# EAGLE design DP2MBPR_1.0 (EAGLE 6.4)

## Sheet 1 of 4: Power Management

## Sheet 2 of 4: Processor
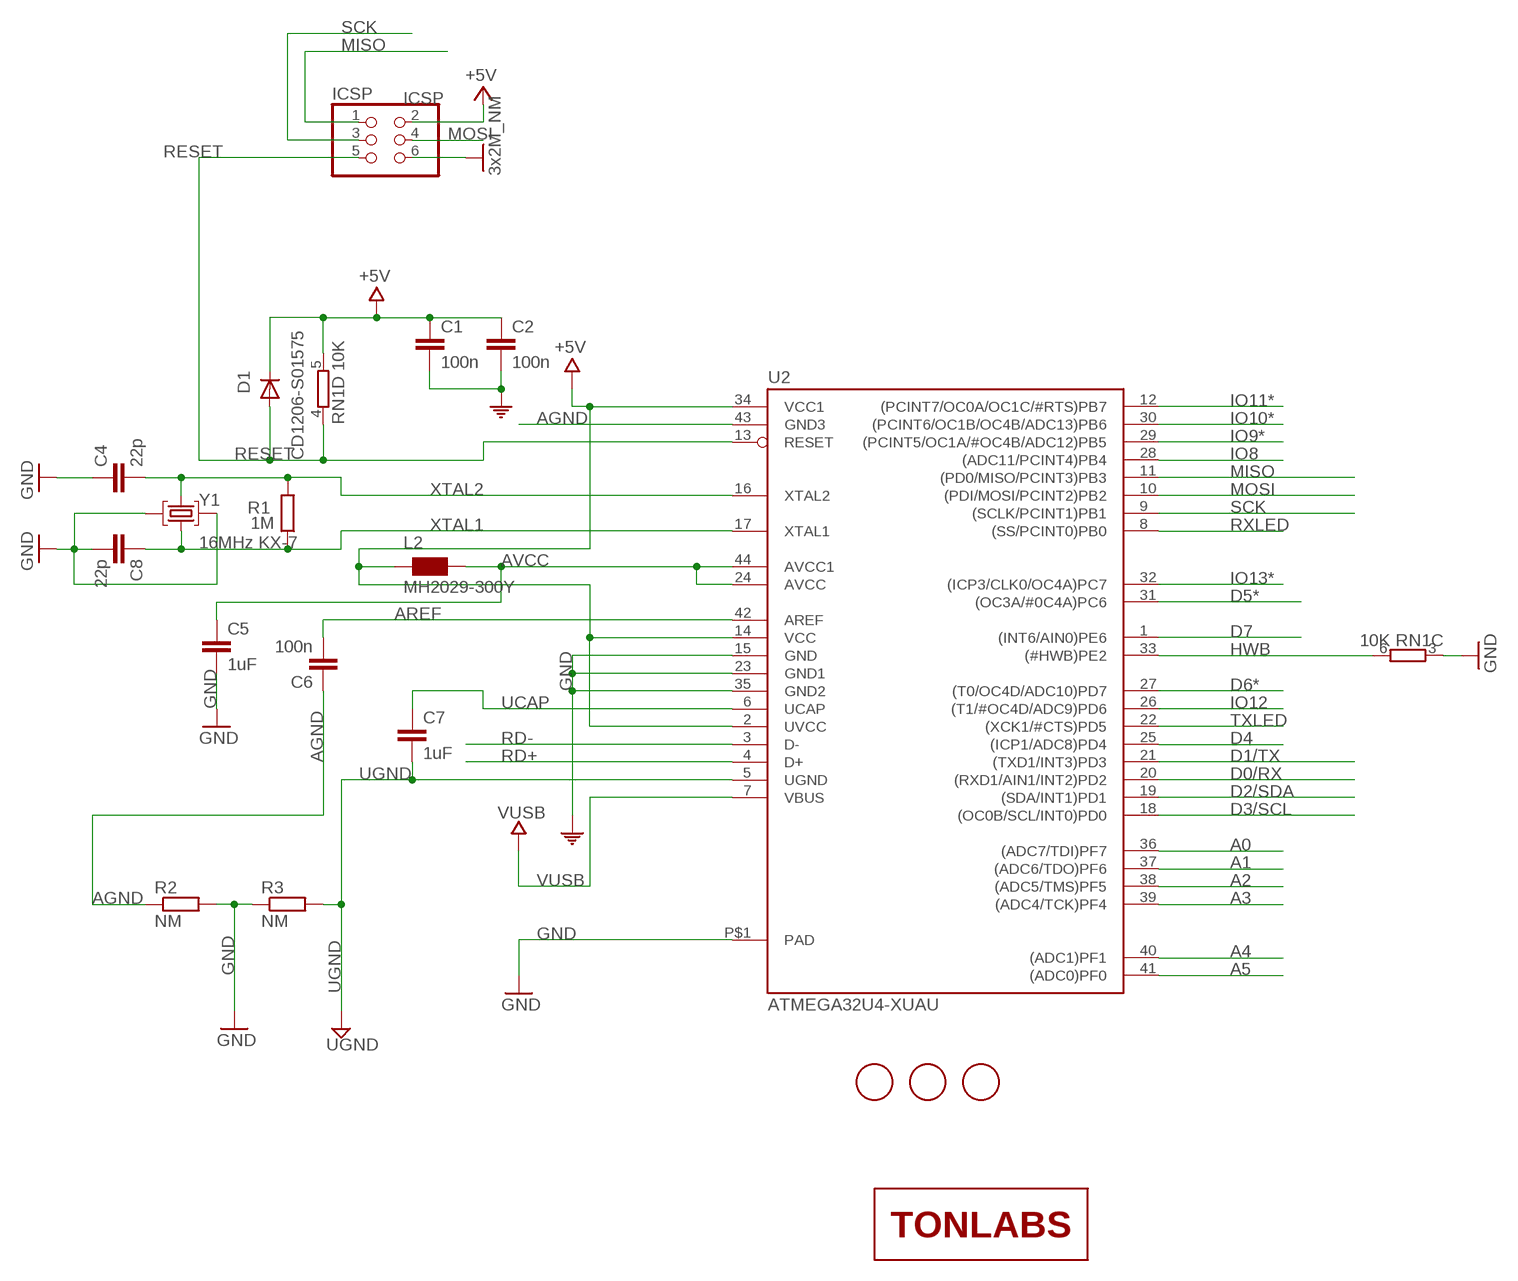
[diagram p0: schematic, sheet 2]

### Parts
C1  100n  C-EUC0603  [C0603-ROUND]
C2  100n  C-EUC0603  [C0603-ROUND]
C4  22p  C-EUC0603  [C0603-ROUND]
C5  1uF  C-EUC0603  [C0603-ROUND]
C6  100n  C-EUC0603  [C0603-ROUND]
C7  1uF  C-EUC0603  [C0603-ROUND]
C8  22p  C-EUC0603  [C0603-ROUND]
D1  CD1206-S01575  DIODE-MINIMELF  [MINIMELF]
FID1  FIDUCIALMOUNT  [FIDUCIA-MOUNT]
FID2  FIDUCIALMOUNT  [FIDUCIA-MOUNT]
FID3  FIDUCIALMOUNT  [FIDUCIA-MOUNT]
ICSP  ICSP  PINHD-2X3  [2X03]
L2  MH2029-300Y  WE-CBF_0805  [0805]
LOGO1  LOGO-TONYLABSMED-LANDSCAPE  [LOGO-TONYLABS-MED-LANDSCAPE]
R1  1M  R-EU_R0603  [R0603-ROUND]
R2  NM  R-EU_R0402  [R0402]
R3  NM  R-EU_R0402  [R0402]
RN1  10K  4R-NCAY16  [CAY16]
U2  ATMEGA32U4-XUAU  [TQFP44-PAD]
Y1  16MHz KX-7  CRYSTAL-3.2-2.5  [CRYSTAL-3.2-2.5]

### Nets
+5V [usbvcc]: C1.1 C2.1 D1.C ICSP.2 L2.1 RN1.5 U2.2(UVCC) U2.14(VCC) U2.34(VCC1)
A0: U2.36((ADC7/TDI)PF7)
A1: U2.37((ADC6/TDO)PF6)
A2: U2.38((ADC5/TMS)PF5)
A3: U2.39((ADC4/TCK)PF4)
A4: U2.40((ADC1)PF1)
A5: U2.41((ADC0)PF0)
AGND: C6.1 R2.1 U2.43(GND3)
AREF [aref]: C6.2 U2.42(AREF)
AVCC: C5.1 L2.2 U2.24(AVCC) U2.44(AVCC1)
D0/RX: U2.20((RXD1/AIN1/INT2)PD2)
D1/TX: U2.21((TXD1/INT3)PD3)
D2/SDA: U2.19((SDA/INT1)PD1)
D3/SCL: U2.18((OC0B/SCL/INT0)PD0)
D4: U2.25((ICP1/ADC8)PD4)
D5*: U2.31((OC3A/#0C4A)PC6)
D6*: U2.27((T0/OC4D/ADC10)PD7)
D7: U2.1((INT6/AIN0)PE6)
GND: C1.2 C2.2 C4.1 C5.2 C8.2 ICSP.6 R2.2 R3.1 RN1.3 U2.15(GND) U2.23(GND1) U2.35(GND2) U2.P$1(PAD) Y1.2(GND) Y1.4(GND) ; supply symbol labelled 3x2M_NM, COM ; also sheet 3,4
HWB: RN1.6 U2.33((#HWB)PE2)
IO8: U2.28((ADC11/PCINT4)PB4)
IO9*: U2.29((PCINT5/OC1A/#OC4B/ADC12)PB5)
IO10*: U2.30((PCINT6/OC1B/OC4B/ADC13)PB6)
IO11*: U2.12((PCINT7/OC0A/OC1C/#RTS)PB7)
IO12: U2.26((T1/#OC4D/ADC9)PD6)
IO13*: U2.32((ICP3/CLK0/OC4A)PC7)
MISO: ICSP.1 U2.11((PD0/MISO/PCINT3)PB3)
MOSI: ICSP.4 U2.10((PDI/MOSI/PCINT2)PB2)
RD+: U2.4(D+)
RD-: U2.3(D-)
RESET: D1.A ICSP.5 RN1.4 U2.13(RESET)
RXLED: U2.8((SS/PCINT0)PB0)
SCK: ICSP.3 U2.9((SCLK/PCINT1)PB1)
TXLED: U2.22((XCK1/#CTS)PD5)
UCAP: C7.1 U2.6(UCAP)
UGND [gnd]: C7.2 R3.2 U2.5(UGND)
VUSB: U2.7(VBUS)
XTAL1: C8.1 R1.1 U2.17(XTAL1) Y1.1(C1)
XTAL2: C4.2 R1.2 U2.16(XTAL2) Y1.3(C2)
Unconnected: RN1.1 RN1.2 RN1.7 RN1.8

## Sheet 3 of 4: Backlight Driver
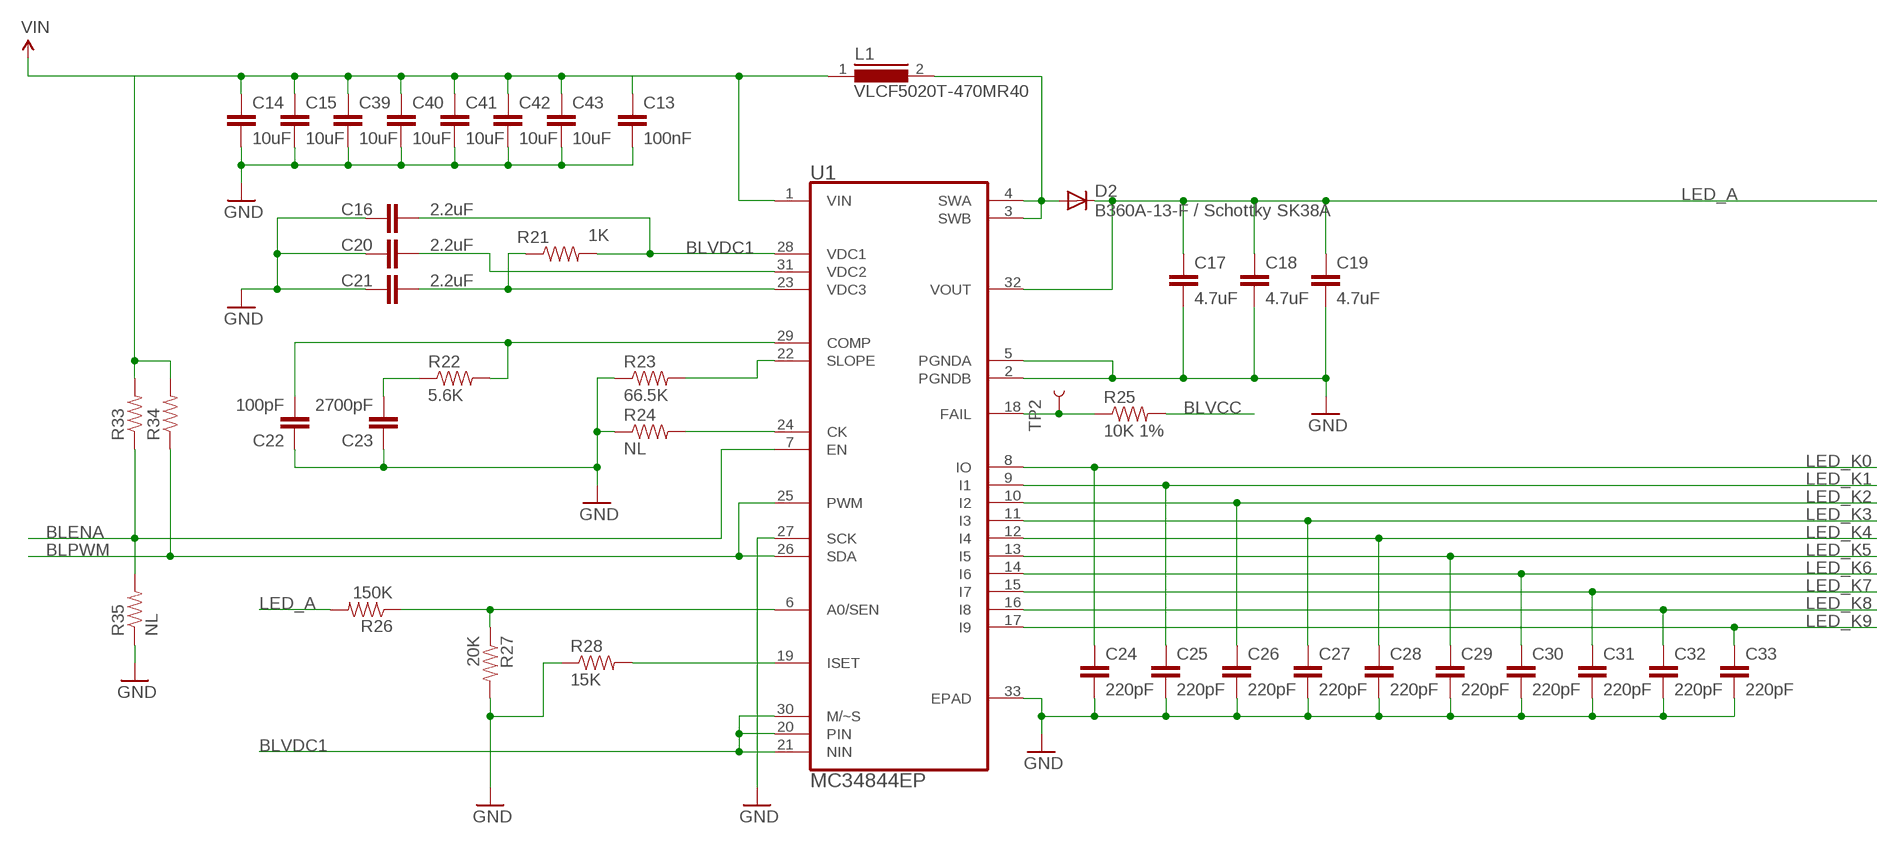
[diagram p1: schematic, sheet 3]

### Parts
C13  100nF  CAP0805  [0805]
C14  10uF  CAP0805  [0805]
C15  10uF  CAP0805  [0805]
C16  2.2uF  CAP0805  [0805]
C17  4.7uF  CAP1210  [1210]
C18  4.7uF  CAP1210  [1210]
C19  4.7uF  CAP1210  [1210]
C20  2.2uF  CAP0805  [0805]
C21  2.2uF  CAP0805  [0805]
C22  100pF  CAP0805  [0805]
C23  2700pF  CAP0805  [0805]
C24  220pF  CAP0603-CAP  [0603-CAP]
C25  220pF  CAP0603-CAP  [0603-CAP]
C26  220pF  CAP0603-CAP  [0603-CAP]
C27  220pF  CAP0603-CAP  [0603-CAP]
C28  220pF  CAP0603-CAP  [0603-CAP]
C29  220pF  CAP0603-CAP  [0603-CAP]
C30  220pF  CAP0603-CAP  [0603-CAP]
C31  220pF  CAP0603-CAP  [0603-CAP]
C32  220pF  CAP0603-CAP  [0603-CAP]
C33  220pF  CAP0603-CAP  [0603-CAP]
C39  10uF  CAP0805  [0805]
C40  10uF  CAP0805  [0805]
C41  10uF  CAP0805  [0805]
C42  10uF  CAP0805  [0805]
C43  10uF  CAP0805  [0805]
D2  B360A-13-F / Schottky SK38A  DIODE-SMB  [SMB]
L1  VLCF5020T-470MR40  SLF7045  [SLF7045]
R21  1K  RESISTOR0603-RES  [0603-RES]
R22  5.6K  RESISTOR0603-RES  [0603-RES]
R23  66.5K  RESISTOR0603-RES  [0603-RES]
R24  NL  RESISTOR0603-RES  [0603-RES]
R25  10K 1%  RESISTOR0603-RES  [0603-RES]
R26  150K  RESISTOR0603-RES  [0603-RES]
R27  20K  RESISTOR0603-RES  [0603-RES]
R28  15K  RESISTOR0603-RES  [0603-RES]
R33  RESISTOR0603-RES  [0603-RES]
R34  RESISTOR0603-RES  [0603-RES]
R35  NL  RESISTOR0603-RES  [0603-RES]
TP2  TEST-POINT3X5  [PAD.03X.05]
U1  MC34844EP  IC-FREESCALE-MC34844EP  [QFN50P500X500X100-33N]

### Nets
BLENA: R33.1 R35.2 U1.7(EN)
BLPWM: R34.1 U1.25(PWM) U1.26(SDA)
BLVCC: R25.2
BLVDC1: C16.2 R21.2 U1.20(PIN) U1.21(NIN) U1.28(VDC1) U1.30(M/~S)
GND: C13.2 C14.2 C15.2 C16.1 C17.2 C18.2 C19.2 C20.1 C21.1 C22.1 C23.1 C24.2 C25.2 C26.2 C27.2 C28.2 C29.2 C30.2 C31.2 C32.2 C33.2 C39.2 C40.2 C41.2 C42.2 C43.2 R23.1 R24.1 R27.2 R28.1 R35.1 U1.2(PGNDB) U1.5(PGNDA) U1.27(SCK) U1.33(EPAD) ; also sheet 2,4
LED_A: C17.1 C18.1 C19.1 D2.C R26.2 U1.32(VOUT) ; also sheet 4
LED_K0: C24.1 U1.8(IO)
LED_K1: C25.1 U1.9(I1) ; also sheet 4
LED_K2: C26.1 U1.10(I2) ; also sheet 4
LED_K3: C27.1 U1.11(I3) ; also sheet 4
LED_K4: C28.1 U1.12(I4) ; also sheet 4
LED_K5: C29.1 U1.13(I5) ; also sheet 4
LED_K6: C30.1 U1.14(I6) ; also sheet 4
LED_K7: C31.1 U1.15(I7)
LED_K8: C32.1 U1.16(I8)
LED_K9: C33.1 U1.17(I9)
N$1: C22.2 R22.2 U1.29(COMP)
N$8: C20.2 U1.31(VDC2)
N$24: R25.1 TP2.P$1 U1.18(FAIL)
N$25: C21.2 R21.1 U1.23(VDC3)
N$39: C23.2 R22.1
N$40: R23.2 U1.22(SLOPE)
N$41: R24.2 U1.24(CK)
N$42: R26.1 R27.1 U1.6(A0/SEN)
N$46: D2.A L1.2 U1.3(SWB) U1.4(SWA)
N$47: R28.2 U1.19(ISET)
VIN: C13.1 C14.1 C15.1 C39.1 C40.1 C41.1 C42.1 C43.1 L1.1 R33.2 R34.2 U1.1(VIN)

## Sheet 4 of 4: Connectors
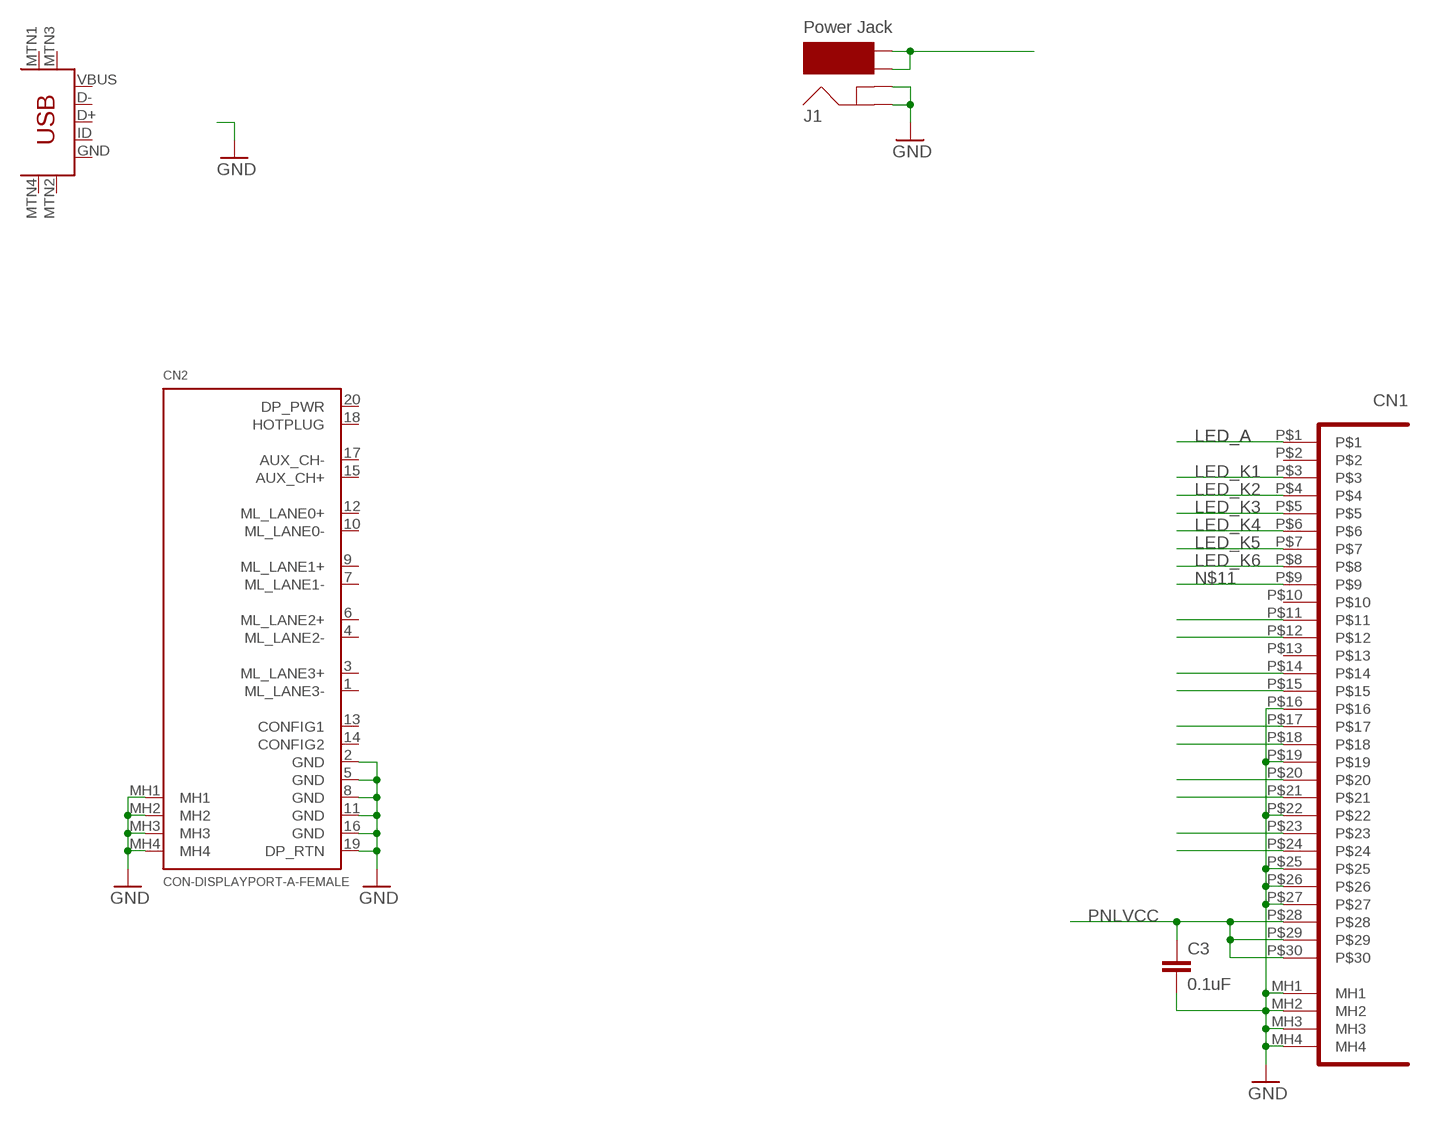
[diagram p2: schematic, sheet 4]

### Parts
C3  0.1uF  CAP0603-CAP  [0603-CAP]
CN1  CON-I_PEX-20474-030E  [CON-I_PEX-20474-030E-0.4PITCH_30PIN-SMT]
CN2  CON-DISPLAYPORT-A-FEMALE  [CON-DISPLAYPORT-FEMALE-SMT]
J1  Power Jack  CON-POWER-JACK-4P  [CON-POWER-JACK-4P]
U$1  USB-MINIB-5PIN  [USB-MINIB]

### Nets
GND: C3.2 CN1.MH1 CN1.MH2 CN1.MH3 CN1.MH4 CN1.P$16 CN1.P$19 CN1.P$22 CN1.P$25 CN1.P$26 CN1.P$27 CN2.2(GND) CN2.5(GND) CN2.8(GND) CN2.11(GND) CN2.16(GND) CN2.19(DP_RTN) CN2.MH1 CN2.MH2 CN2.MH3 CN2.MH4 J1.GND J1.P$4(GNDBREAK) ; also sheet 2,3
LED_A: CN1.P$1 ; also sheet 3
LED_K1: CN1.P$3 ; also sheet 3
LED_K2: CN1.P$4 ; also sheet 3
LED_K3: CN1.P$5 ; also sheet 3
LED_K4: CN1.P$6 ; also sheet 3
LED_K5: CN1.P$7 ; also sheet 3
LED_K6: CN1.P$8 ; also sheet 3
N$11: CN1.P$9
N$13: CN1.P$11
N$14: CN1.P$12
N$16: CN1.P$14
N$17: CN1.P$15
N$19: CN1.P$17
N$20: CN1.P$18
N$22: CN1.P$20
N$23: CN1.P$21
N$27: CN1.P$23
N$28: CN1.P$24
N$44: J1.VIN0(PWR) J1.VIN1(PWR1)
PNLVCC: C3.1 CN1.P$28 CN1.P$29 CN1.P$30
Unconnected: CN1.P$2 CN1.P$10 CN1.P$13 CN2.1(ML_LANE3-) CN2.3(ML_LANE3+) CN2.4(ML_LANE2-) CN2.6(ML_LANE2+) CN2.7(ML_LANE1-) CN2.9(ML_LANE1+) CN2.10(ML_LANE0-) CN2.12(ML_LANE0+) CN2.13(CONFIG1) CN2.14(CONFIG2) CN2.15(AUX_CH+) CN2.17(AUX_CH-) CN2.18(HOTPLUG) CN2.20(DP_PWR) U$1.D+ U$1.D- U$1.GND U$1.ID U$1.MTN1(MTN2) U$1.MTN2(MTN3) U$1.MTN3(MTN1) U$1.MTN4 U$1.VBUS

## Library data of the parts
C1 C2 C4-C8 = SmartPrj:C-EU: CAPACITOR, European symbol
C3 C13-C33 C39-C43 = SparkFun-Passives:CAP: Capacitor Standard 0603 ceramic capacitor, and 0.1" leaded capacitor.
CN1 = TONYLABS:CON-I_PEX-20474-030E
CN2 = TONYLABS:CON-DISPLAYPORT-A-FEMALE: Displayport Female 20pin SMT
D1 D2 = diode:DIODE-: DIODE
FID1-FID3 = SmartPrj:FIDUCIALMOUNT
ICSP = SmartPrj:PINHD-2X3: PIN HEADER
J1 = TONYLABS:CON-POWER-JACK-4P
L1 = inductors:SLF7045: SMD Inductors(Coils) For Power Line (Wound, Magnetic Shielded) Source: TDK, e531_slf7045.pdf
L2 = wuerth-elektronik:WE-CBF: SMD EMI Suppression Ferrite Beads - excellent anti-EMI properties - low DCR - impedances till 3000 ohms - rated current up to 6 A
LOGO1 = TONYLABS:LOGO-TONYLABS
R1-R3 = SmartPrj:R-EU_: RESISTOR, European symbol
R21-R28 R33-R35 = SparkFun-Passives:RESISTOR: Resistor Basic schematic elements and footprints for 0603, 1206, and PTH resistors.
RN1 = resistor-dil:4R-N: Array Chip Resistor Source: RS Component / Phycomp
TP2 = SparkFun-Passives:TEST-POINT: Bare copper test points for troubleshooting or ICT
U1 = TONYLABS:IC-FREESCALE-MC34844EP: 10 Channel LED Backlight Driver; MPN: MC34844EP; OC_FARNELL: 1701636; OC_NEWARK: 40P5024; PACKAGE: QFN-32; SUPPLIER: FREESCALE SEMICONDUCTOR
U2 = SmartPrj:ATMEGA32U4-XU
U$1 = SparkFun-Connectors:USB-MINIB: Mini-USB "B" connector with 5th pin broken out. Created new symbol breaking out 5th "ID" pin in mini/micro USB connector spec. See: http://en.wikipedia.org/wiki/Mini_usb#Cables. Uses same footprint as 4-pin symbol. Also added pins to connect to mounting / shield pads if required (probably not generally needed as signals aren't shielded once they leave the connector).
Y1 = SmartPrj:CRYSTAL-3.2-2.5

## Net classes
0 default: width 0.254 mm, drill 0.61 mm, clearance 0.254 mm
1 power: width 0.254 mm, drill 0.61 mm, clearance 0.254 mm
2 gnd: width 0.254 mm, drill 0.61 mm, clearance 0.254 mm
3 usbvcc: width 0.254 mm, drill 0.61 mm, clearance 0.254 mm
4 aref: width 0.254 mm, drill 0.61 mm, clearance 0.254 mm

## Board
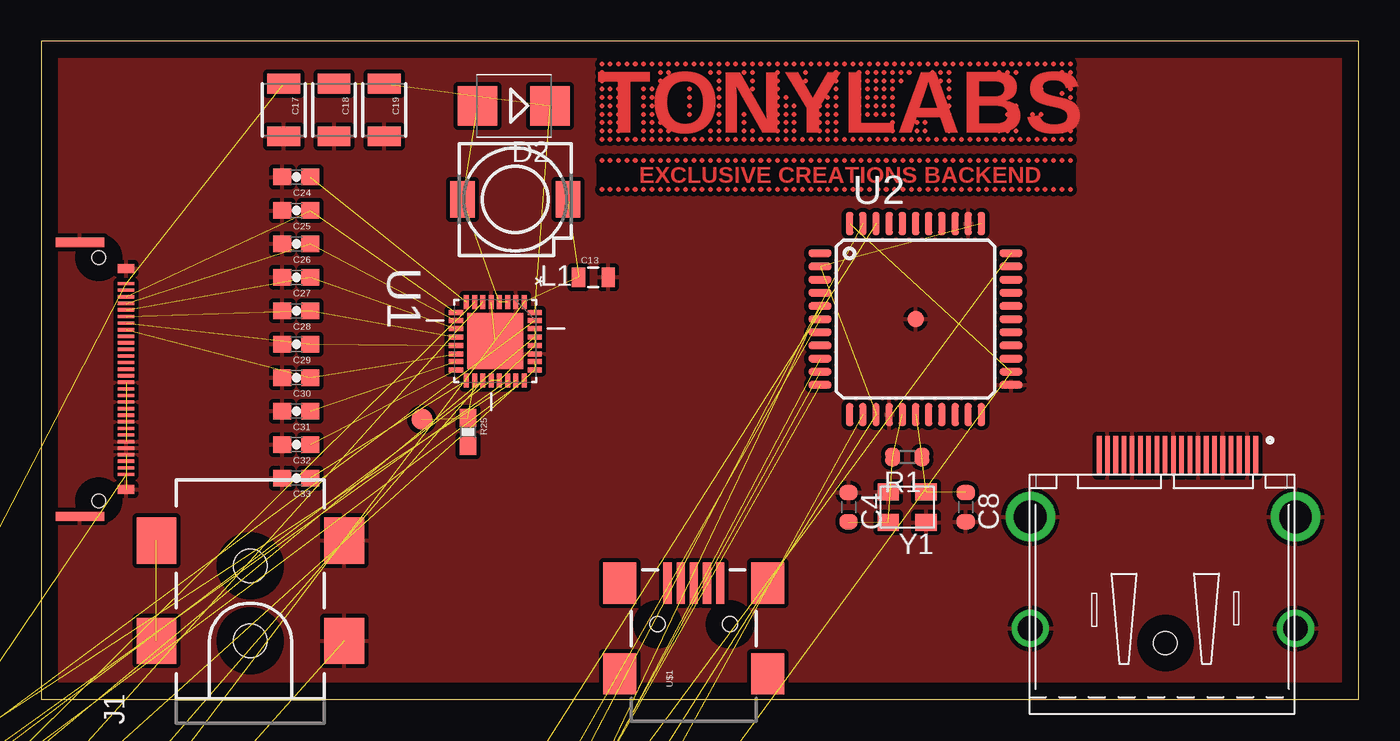
[diagram p3: board, top side]
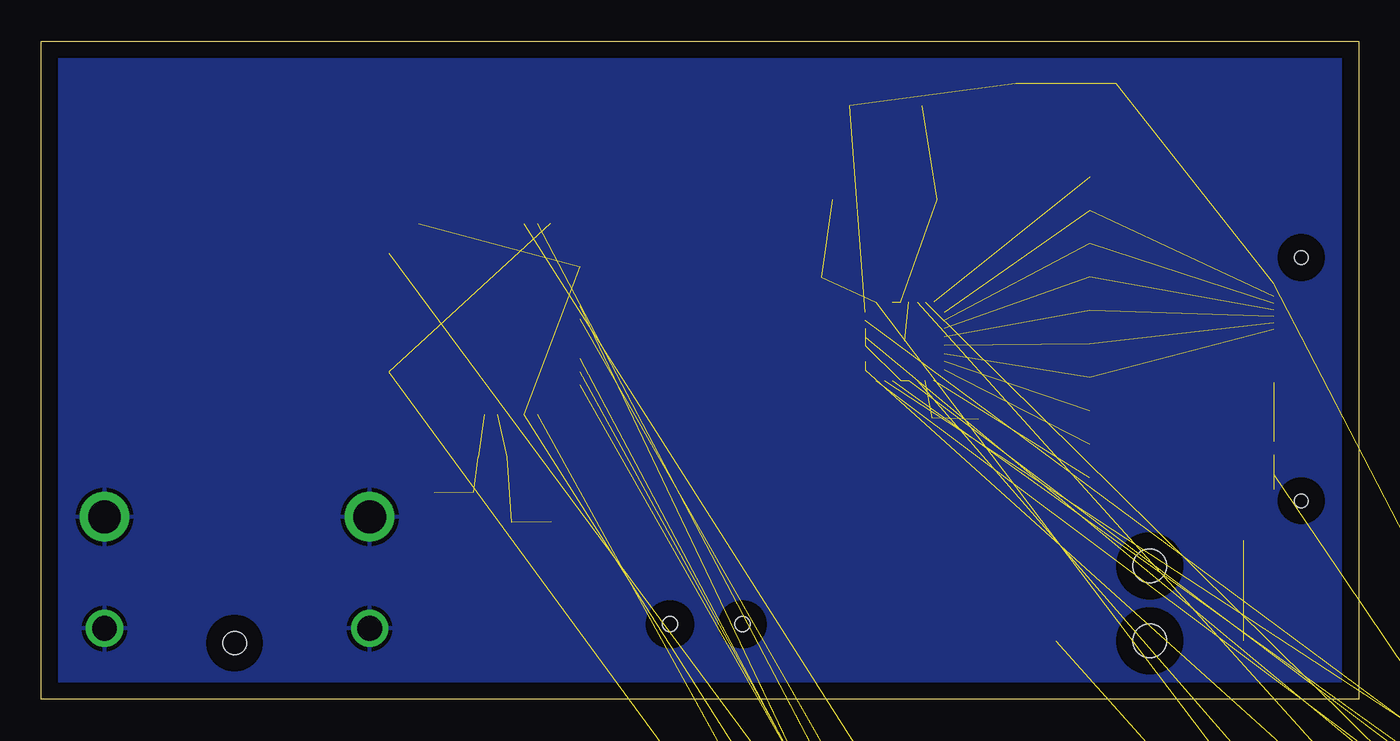
[diagram p4: board, bottom side, seen from below]

Size 80 x 40 mm. Coordinates in mm from the lower left corner, seen from the top.
Outline: 0,0 80,0 80,40 0,40 0,0
Copper layers (1*2+15*16): Top 0.035mm / dielectric 1.5mm / Route2 0.035mm / dielectric 0.15mm / Route15 0.035mm / dielectric 0.2mm / Bottom 0.035mm
Design rules "default *": minimum track width 10mil, minimum drill 24mil, track to track 8mil, track to pad 8mil, pad to pad 8mil, via to via 8mil, smd to smd 8mil, copper to edge 40mil, drill to drill 8mil, minimum pad ring 10mil, minimum via ring 8mil, stop-mask expansion 4mil, vias tented up to drill 0mil, thermal gap 10mil

### Footprints (pad centres in the part's own frame; a part is rotated, then mirrored left to right if it is on the bottom)
C0603-ROUND = smd 0.898 x 1.1: 1 -0.889,0; 2 0.889,0
0603-CAP = smd 1.1 x 1: 1 -0.85,0; 2 0.85,0
0805 = smd 0.8 x 1.2: 1 -0.9,0; 2 0.9,0
1210 = smd 1.2 x 2: 1 -1.6,0; 2 1.6,0
CON-I_PEX-20474-030E-0.4PITCH_30PIN-SMT = smd 0.55 x 1: MH1 1.6,2.8; MH2 15,2.8 | smd 0.56 x 2.95: MH3 16.64,0; MH4 0,0 | smd 0.2 x 1: P$1 2.5,2.8; P$2 2.9,2.8; P$3 3.3,2.8; P$4 3.7,2.8; P$5 4.1,2.8; P$6 4.5,2.8; P$7 4.9,2.8; P$8 5.3,2.8; P$9 5.7,2.8; P$10 6.1,2.8; P$11 6.5,2.8; P$12 6.9,2.8; P$13 7.3,2.8; P$14 7.7,2.8; P$15 8.1,2.8; P$16 8.5,2.8; P$17 8.9,2.8; P$18 9.3,2.8; P$19 9.7,2.8; P$20 10.1,2.8; P$21 10.5,2.8; P$22 10.9,2.8; P$23 11.3,2.8; P$24 11.7,2.8; P$25 12.1,2.8; P$26 12.5,2.8; P$27 12.9,2.8; P$28 13.3,2.8; P$29 13.7,2.8; P$30 14.1,2.8 | hole 0.8: 0.92,1.145; 15.7,1.145
CON-DISPLAYPORT-FEMALE-SMT = smd 0.28 x 2.4: 1 5.485,8.326; 2 4.985,8.326; 3 4.485,8.326; 4 3.985,8.326; 5 3.485,8.326; 6 2.985,8.326; 7 2.485,8.326; 8 1.985,8.326; 9 1.485,8.326; 10 0.985,8.326; 11 0.485,8.326; 12 -0.015,8.326; 13 -0.515,8.326; 14 -1.015,8.326; 15 -1.515,8.326; 16 -2.015,8.326; 17 -2.515,8.326; 18 -3.015,8.326; 19 -3.515,8.326; 20 -4.015,8.326 | drill 2 pad 2.54: MH1 -8.2,4.61; MH2 7.9,4.61 | drill 1.5 pad 1.8: MH3 7.9,-2.17; MH4 -8.2,-2.17 | hole 1.4: -0.005,-3.07
MINIMELF = smd 1.4 x 1.8: A 1.7,0; C -1.7,0
SMB = smd 2.4 x 2.4: A 2.2,0; C -2.2,0
FIDUCIA-MOUNT = smd 1.016 x 1.016: P$1 0,0
2X03 = drill 0.95 pad 1.55 octagon: 1 -2.54,-1.27; 2 -2.54,1.27; 3 0,-1.27; 4 0,1.27; 5 2.54,-1.27; 6 2.54,1.27
CON-POWER-JACK-4P = smd 2.8 x 2.4: GND -2.54,-5.7; P$4 3.56,-5.7; VIN0 -2.54,5.7; VIN1 3.56,5.7 | hole 2.032: -2.54,0; 2.032,0
SLF7045 = smd 1.5 x 2.2: 1 -3.2,0; 2 3.2,0
0805' = smd 1.2 x 1: 1 -1.1,0; 2 1.1,0
R0603-ROUND = smd 0.898 x 1.1: 1 -0.889,0; 2 0.889,0
R0402 = smd 0.7 x 0.9: 1 -0.65,0; 2 0.65,0
0603-RES = smd 1.1 x 1: 1 -0.85,0; 2 0.85,0
CAY16 = smd 0.5 x 0.65: 1 -1.2,-0.675; 2 -0.4,-0.675; 3 0.4,-0.675; 4 1.2,-0.675; 5 1.2,0.675; 6 0.4,0.675; 7 -0.4,0.675; 8 -1.2,0.675
PAD.03X.05 = smd 1.27 x 1.27: P$1 0,0
QFN50P500X500X100-33N = smd 0.864 x 0.305: 1 -2.388,1.753; 2 -2.388,1.245; 3 -2.388,0.762; 4 -2.388,0.254; 5 -2.388,-0.254; 6 -2.388,-0.762; 7 -2.388,-1.245; 8 -2.388,-1.753; 17 2.388,-1.753; 18 2.388,-1.245; 19 2.388,-0.762; 20 2.388,-0.254; 21 2.388,0.254; 22 2.388,0.762; 23 2.388,1.245; 24 2.388,1.753 | smd 0.305 x 0.864: 9 -1.753,-2.388; 10 -1.245,-2.388; 11 -0.762,-2.388; 12 -0.254,-2.388; 13 0.254,-2.388; 14 0.762,-2.388; 15 1.245,-2.388; 16 1.753,-2.388; 25 1.753,2.388; 26 1.245,2.388; 27 0.762,2.388; 28 0.254,2.388; 29 -0.254,2.388; 30 -0.762,2.388; 31 -1.245,2.388; 32 -1.753,2.388 | smd 3.404 x 3.404: 33 0,0
TQFP44-PAD = smd 1.4 x 0.45: 1 -5.8,4; 2 -5.8,3.2; 3 -5.8,2.4; 4 -5.8,1.6; 5 -5.8,0.8; 6 -5.8,0; 7 -5.8,-0.8; 8 -5.8,-1.6; 9 -5.8,-2.4; 10 -5.8,-3.2; 11 -5.8,-4; 23 5.8,-4; 24 5.8,-3.2; 25 5.8,-2.4; 26 5.8,-1.6; 27 5.8,-0.8; 28 5.8,0; 29 5.8,0.8; 30 5.8,1.6; 31 5.8,2.4; 32 5.8,3.2; 33 5.8,4 | smd 0.45 x 1.4: 12 -4,-5.8; 13 -3.2,-5.8; 14 -2.4,-5.8; 15 -1.6,-5.8; 16 -0.8,-5.8; 17 0,-5.8; 18 0.8,-5.8; 19 1.6,-5.8; 20 2.4,-5.8; 21 3.2,-5.8; 22 4,-5.8; 34 4,5.8; 35 3.2,5.8; 36 2.4,5.8; 37 1.6,5.8; 38 0.8,5.8; 39 0,5.8; 40 -0.8,5.8; 41 -1.6,5.8; 42 -2.4,5.8; 43 -3.2,5.8; 44 -4,5.8 | smd 1 x 1: P$1 0,0
USB-MINIB = smd 2.5 x 0.5: D+ 2.5,0; D- 2.5,0.8; GND 2.5,-1.6; ID 2.5,-0.8; VBUS 2.5,1.6 | smd 2.5 x 2: MTN1 -3,4.5; MTN2 2.5,4.5; MTN3 -3,-4.5; MTN4 2.5,-4.5 | hole 0.9: 0,2.2; 0,-2.2
CRYSTAL-3.2-2.5 = smd 1.3 x 1.05: 1 -1.15,-0.925; 2 1.15,-0.925; 3 1.15,0.925; 4 -1.15,0.925

### Placement (x,y rotation side)
C1  -35.05,-88.65 0 top  (outside the outline)
C2  -29.97,-88.65 0 top  (outside the outline)
C3  -35.05,-46.99 0 top  (outside the outline)
C4  49.02,11.68 270 top
C5  -19.81,-88.65 0 top  (outside the outline)
C6  -24.89,-88.65 0 top  (outside the outline)
C7  -15.49,-88.65 0 top  (outside the outline)
C8  56.13,11.68 270 top
C13  33.53,25.65 0 top
C14  -1.52,-17.78 0 top  (outside the outline)
C15  -4.57,-17.78 0 top  (outside the outline)
C16  -22.86,-17.78 0 top  (outside the outline)
C17  14.73,35.81 270 top
C18  17.78,35.81 270 top
C19  20.83,35.81 270 top
C20  -25.91,-17.78 0 top  (outside the outline)
C21  -28.96,-17.78 0 top  (outside the outline)
C22  -32,-42.93 0 top  (outside the outline)
C23  -35.05,-42.93 0 top  (outside the outline)
C24  15.49,31.75 180 top
C25  15.49,29.72 180 top
C26  15.49,27.69 180 top
C27  15.49,25.65 180 top
C28  15.49,23.62 180 top
C29  15.49,21.59 180 top
C30  15.49,19.56 180 top
C31  15.49,17.53 180 top
C32  15.49,15.49 180 top
C33  15.49,13.46 180 top
C39  -7.62,-17.78 0 top  (outside the outline)
C40  -10.67,-17.78 0 top  (outside the outline)
C41  -13.72,-17.78 0 top  (outside the outline)
C42  -16.76,-17.78 0 top  (outside the outline)
C43  -19.81,-17.78 0 top  (outside the outline)
CN1  2.35,27.77 270 top
CN2  68.25,6.49 0 top
D1  -17.78,-82.8 0 top  (outside the outline)
D2  28.7,36.07 180 top
FID1  -24.38,-92.96 0 top  (outside the outline)
FID2  -21.08,-92.96 0 top  (outside the outline)
FID3  -17.78,-92.96 0 top  (outside the outline)
ICSP  -2.79,-72.39 0 top  (outside the outline)
J1  12.7,6.1 90 top
L1  28.78,30.38 180 top
L2  MH2029-300Y  [0805']  -29.97,-92.96 0 top  (outside the outline)
LOGO1  48.26,34.8 0 top
R1  52.58,14.73 180 top
R2  -11.18,-88.65 0 top  (outside the outline)
R3  -6.86,-88.65 0 top  (outside the outline)
R21  -28.96,-28.7 0 top  (outside the outline)
R22  -28.96,-26.16 0 top  (outside the outline)
R23  -28.96,-21.08 0 top  (outside the outline)
R24  -28.96,-23.62 0 top  (outside the outline)
R25  25.91,16.26 270 top
R26  -28.96,-38.86 0 top  (outside the outline)
R27  -28.96,-41.4 0 top  (outside the outline)
R28  -28.96,-43.94 0 top  (outside the outline)
R33  -28.96,-31.24 0 top  (outside the outline)
R34  -28.96,-33.78 0 top  (outside the outline)
R35  -28.96,-36.32 0 top  (outside the outline)
RN1  -22.61,-83.06 0 top  (outside the outline)
TP2  23.11,17.02 0 top
U1  27.57,21.77 270 top
U2  53.09,23.11 0 top
U$1  39.62,4.57 90 top
Y1  52.58,11.68 180 top

### Tracks (layer width: path | path; a pad name or v marks a point on that pad's centre or on a via)
+5V  (8 unrouted)
AGND  (2 unrouted)
AREF  (1 unrouted)
AVCC  (3 unrouted)
BLENA  (2 unrouted)
BLPWM  (2 unrouted)
BLVDC1  (5 unrouted)
GND  (30 unrouted)
  pour Top: 0,40.39 80.26,40.39 80.26,-0.25 -0.25,-0.25 -0.25,40.39
  pour Bottom: 0,40.64 80.77,40.64 80.77,-0.76 -0.76,-0.76 -0.76,40.64
HWB  (1 unrouted)
LED_A  (6 unrouted)
LED_K0  (1 unrouted)
LED_K1  (2 unrouted)
LED_K2  (2 unrouted)
LED_K3  (2 unrouted)
LED_K4  (2 unrouted)
LED_K5  (2 unrouted)
LED_K6  (2 unrouted)
LED_K7  (1 unrouted)
LED_K8  (1 unrouted)
LED_K9  (1 unrouted)
MISO  (1 unrouted)
MOSI  (1 unrouted)
N$1  (2 unrouted)
N$8  (1 unrouted)
N$24  (2 unrouted)
N$25  (2 unrouted)
N$39  (1 unrouted)
N$40  (1 unrouted)
N$41  (1 unrouted)
N$42  (2 unrouted)
N$44  (1 unrouted)
N$46  (3 unrouted)
N$47  (1 unrouted)
PNLVCC  (3 unrouted)
RESET  (3 unrouted)
SCK  (1 unrouted)
UCAP  (1 unrouted)
UGND  (2 unrouted)
VIN  (11 unrouted)
XTAL1  (3 unrouted)
XTAL2  (3 unrouted)